# Altium project TK105_Hodetelefonforsterker.PrjPCB
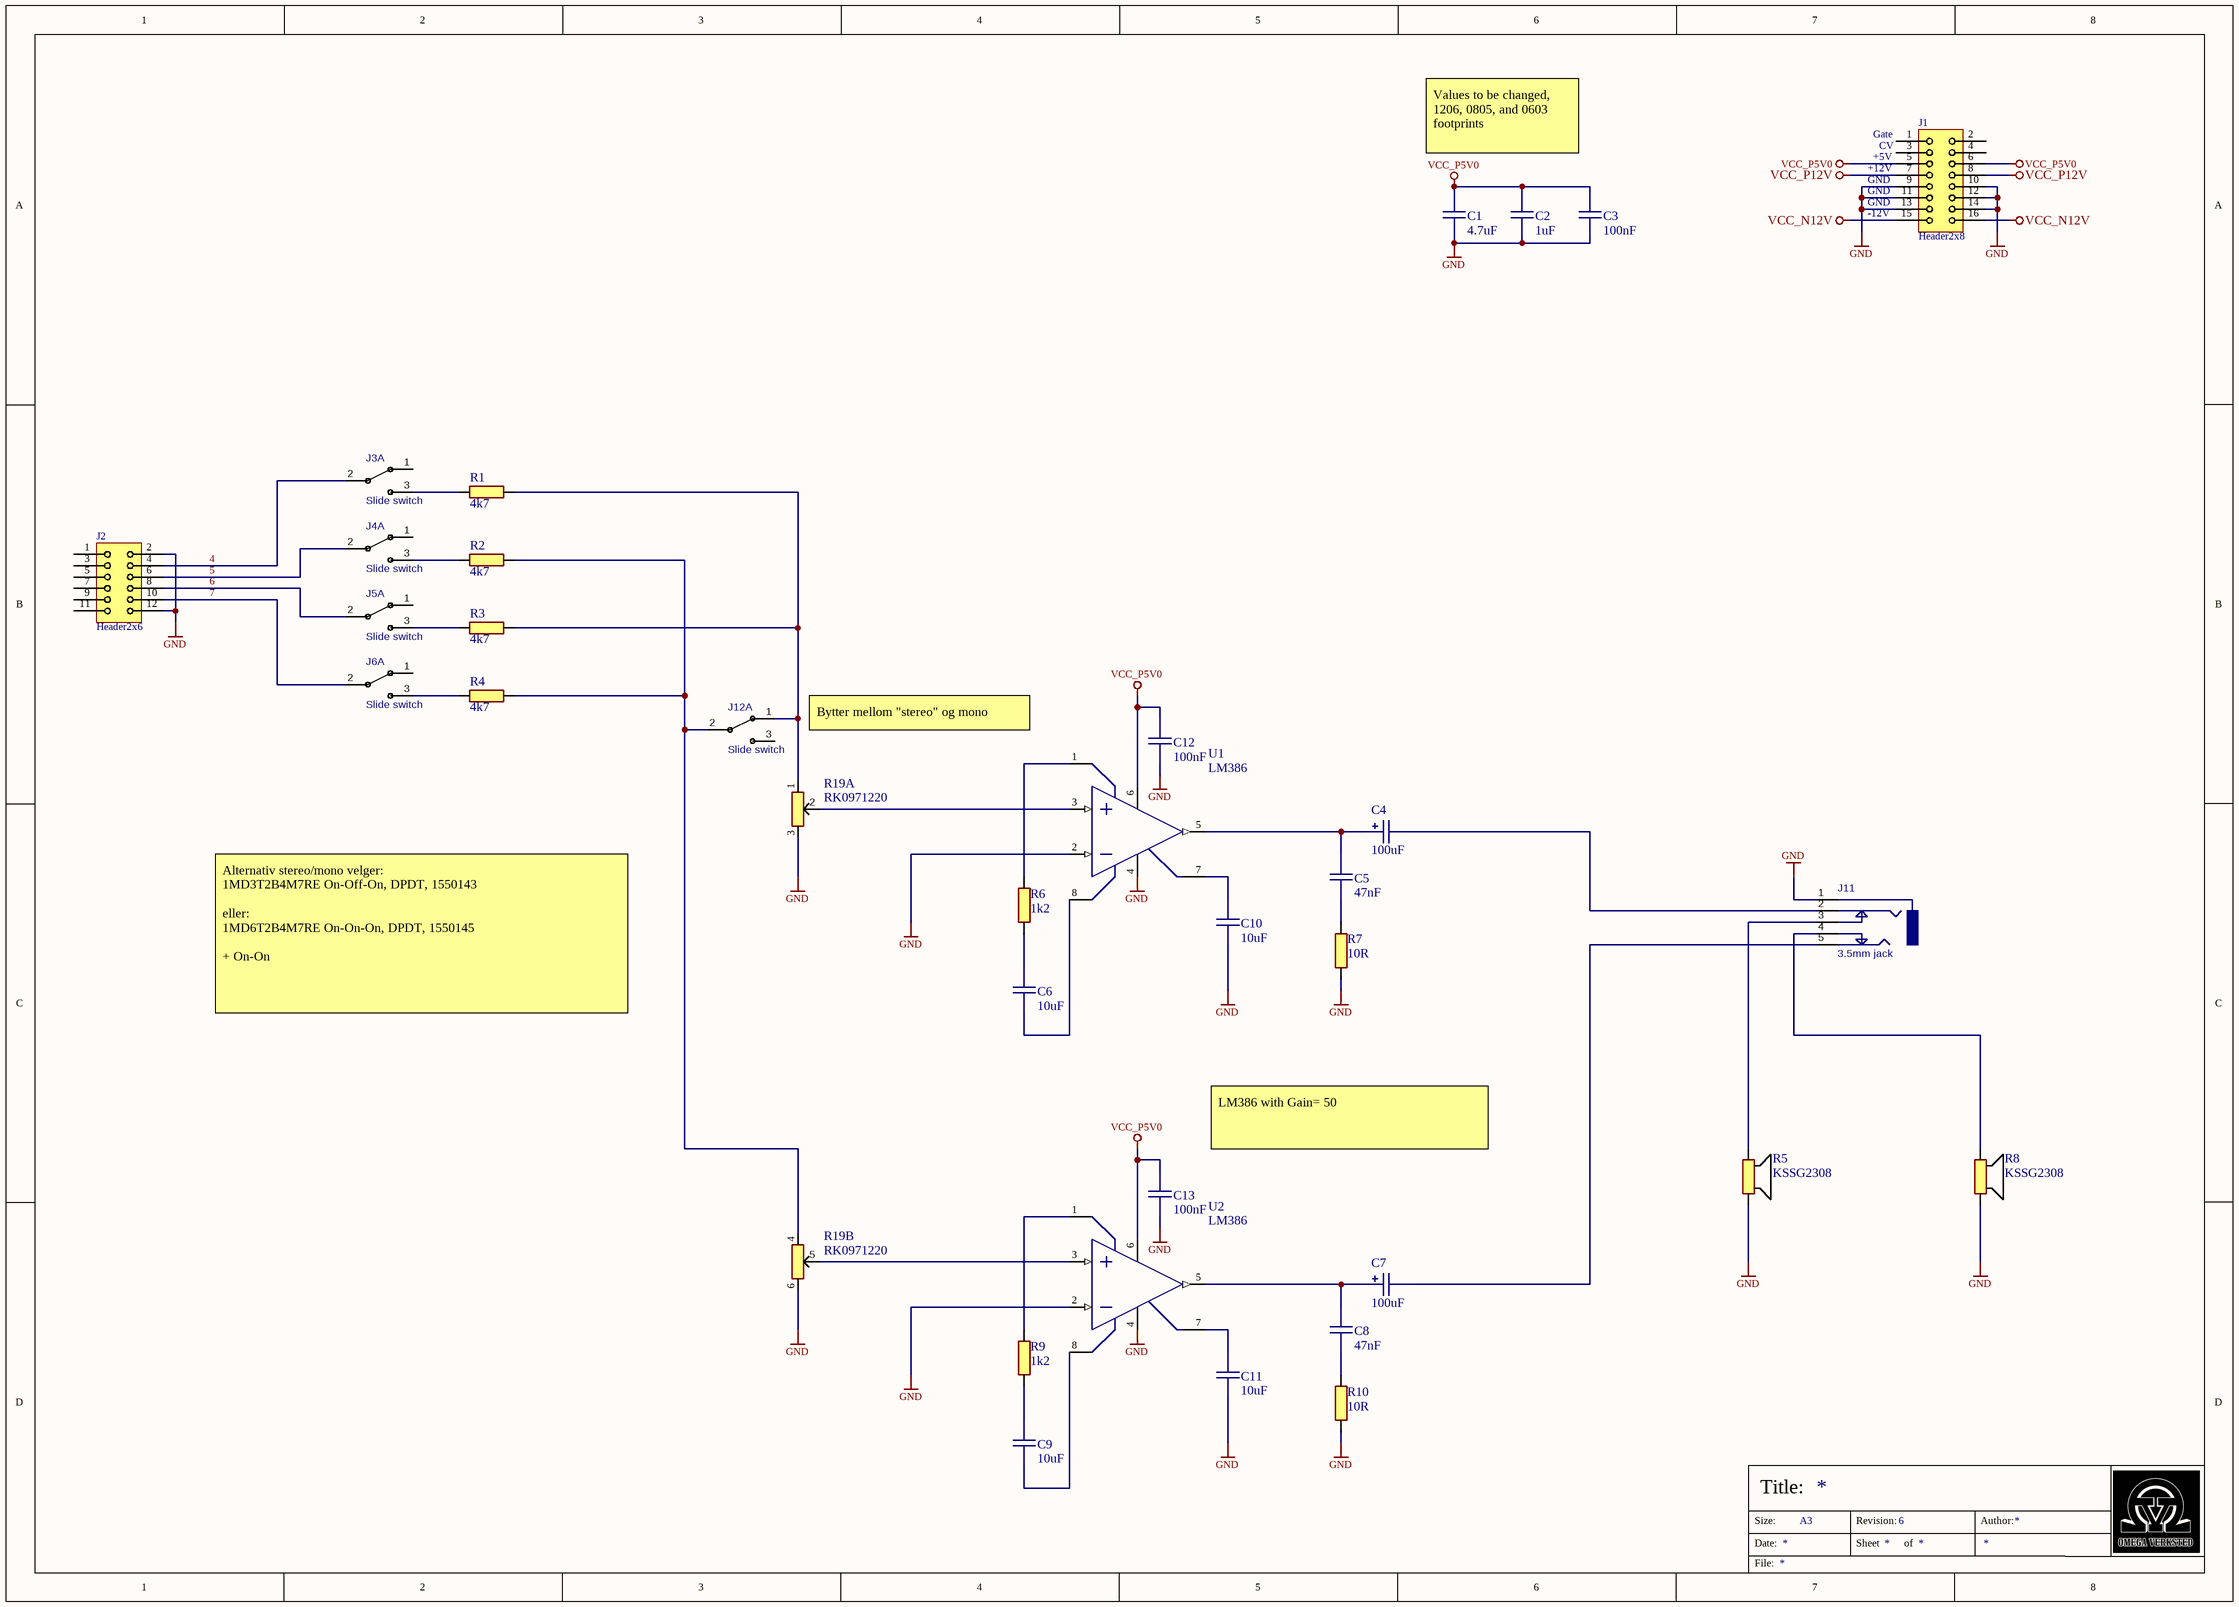
[diagram p0: TK105_Hodetelefonforsterker.SchDoc]
1 sheet, 34 parts. Net scope: global (net labels, ports and power ports of the same name join across sheets).
Board file: TK105_Hodetelefonforsterker.PcbDoc

## Sheet TK105_Hodetelefonforsterker.SchDoc
size A3; Revision: 6

### Parts
C1  4.7uF  [CAPC1206(3216)170_N]
C2  1uF  [CAPC0805(2012)100_N]
C3  100nF  [CAPC0603(1608)55_N]
C4  100uF  [CAPPR25D06H11]
C5  47nF  [CAPC0603(1608)55_N]
C6  10uF  [CAPC0805(2012)100_N]
C7  100uF  [CAPPR25D06H11]
C8  47nF  [CAPC0603(1608)55_N]
C9  10uF  [CAPC0805(2012)100_N]
C10  10uF  [CAPC0805(2012)100_N]
C11  10uF  [CAPC0805(2012)100_N]
C12  100nF  [CAPC0603(1608)55_N]
C13  100nF  [CAPC0603(1608)55_N]
J1  Header2x8  [HDRV16W64P254_2X8_Shrouded]
J2  Header2x6  [HDRV12W64P254_2X6_RA]
J3  Slide switch  [1MS1T2B4M7RE]  (part A of 2)
J4  Slide switch  [1MS1T2B4M7RE]  (part A of 2)
J5  Slide switch  [1MS1T2B4M7RE]  (part A of 2)
J6  Slide switch  [1MS1T2B4M7RE]  (part A of 2)
J11  3.5mm jack  [PJ-306M]
J12  Slide switch  [1MS1T2B4M7RE]  (part A of 2)
R1  4k7  [RESC0603(1608)_N]
R2  4k7  [RESC0603(1608)_N]
R3  4k7  [RESC0603(1608)_N]
R4  4k7  [RESC0603(1608)_N]
R5  KSSG2308  [KSSG2308]
R6  1k2  [RESC0603(1608)_N]
R7  10R  [RESC0603(1608)_N]
R8  KSSG2308  [KSSG2308]
R9  1k2  [RESC0603(1608)_N]
R10  10R  [RESC0603(1608)_N]
R19  RK0971220  [RK0971220]  (parts A,B of 2)
U1  LM386  [SOIC127P590X363-8N]
U2  LM386  [SOIC127P590X363-8N]

### Nets
GND: C1.1 C2.1 C3.1 C10.1 C11.1 C12.1 C13.1 J1.9 J1.10 J1.11 J1.12 J1.13 J1.14 J2.2 J2.12 J11.1 R5.2 R7.1 R8.2 R10.1 R19.3 R19.6 U1.2(IN-) U1.4(GND) U2.2(IN-) U2.4(GND)
VCC_N12V: J1.15 J1.16
VCC_P5V0: C1.2 C2.2 C3.2 C12.2 C13.2 J1.5 J1.6 U1.6(Vs) U2.6(Vs)
VCC_P12V: J1.7 J1.8
4: J2.4 J3.2
5: J2.6 J4.2
6: J2.8 J5.2
7: J2.10 J6.2
NetC4_1: C4.1 J11.2
NetC4_2: C4.2 C5.2 U1.5(OUT)
NetC5_1: C5.1 R7.2
NetC6_1: C6.1 U1.8(GAIN)
NetC6_2: C6.2 R6.1
NetC7_1: C7.1 J11.5
NetC7_2: C7.2 C8.2 U2.5(OUT)
NetC8_1: C8.1 R10.2
NetC9_1: C9.1 U2.8(GAIN)
NetC9_2: C9.2 R9.1
NetC10_2: C10.2 U1.7(BYPASS)
NetC11_2: C11.2 U2.7(BYPASS)
NetJ3_3: J3.3 R1.1
NetJ4_3: J4.3 R2.1
NetJ5_3: J5.3 R3.1
NetJ6_3: J6.3 R4.1
NetJ11_3: J11.3 R5.1
NetJ11_4: J11.4 R8.1
NetJ12_1: J12.1 R1.2 R3.2 R19.1
NetJ12_2: J12.2 R2.2 R4.2 R19.4
NetR6_2: R6.2 U1.1(GAIN)
NetR9_2: R9.2 U2.1(GAIN)
NetR19_2: R19.2 U1.3(IN+)
NetR19_5: R19.5 U2.3(IN+)

Not connected (* = marked no-connect by the designer): J1 1 2 3 4; J2 1 3 5 7 9 11; J3 1; J4 1; J5 1; J6 1; J12 3

### Notes on the sheet
- Values to be changed, 1206, 0805, and 0603 footprints
- (near J1) GND
- (near J1) +12V
- (near J1) +5V
- (near J1) Gate
- (near J1) CV
- (near J1) -12V
- Bytter mellom "stereo" og mono
- Alternativ stereo/mono velger:
  1MD3T2B4M7RE On-Off-On, DPDT, 1550143
  eller:
  1MD6T2B4M7RE On-On-On, DPDT, 1550145
  + On-On
- LM386 with Gain= 50
- Size:
- Date:
- Title:
- A3
- Revision:
- Sheet
- of
- Author:
- File:

### Library data of the parts
C1 = 2992: X7R 50V; id: 2992; pakke_opprettet_av: 815; pakke_opprettet: 11.02.2015 13.21.22; symbol_opprettet: 14.11.2014 20.19.34; pris: 1; nokkelord: Kondensator, capacitor; produsent: Multikomp; pakketype: 1206; symbol_opprettet_av: 815; navn: 4.7uF
C2 = 3582: X7R 50V 10%; id: 3582; pakke_opprettet_av: 815; pakke_opprettet: 14.11.2014 20.52.01; symbol_opprettet: 14.11.2014 20.19.34; leverandor_varenr: 1735541; pris: 4; nokkelord: Kondensator, capacitor; produsent: Murata; leverandor: Farnell; pakketype: 0805; symbol_opprettet_av: 815; navn: 1uF
C3 = 3028: X7R 50V 5%; id: 3028; pakke_opprettet_av: 815; pakke_opprettet: 18.02.2015 14.18.13; symbol_opprettet: 14.11.2014 20.19.34; leverandor_varenr: 1759122; pris: 1; nokkelord: Kondensator, Capacitor, CAP; produsent: Multikomp; leverandor: Farnell; pakketype: 0603; symbol_opprettet_av: 815; navn: 100nF
C4 C7 = 4858: 25V 2.5mm pitch; id: 4858; rad: 7; rom: OV; lager_type: Fremlager; dybde: 1; hylle: 4; antall: 40; pakke_opprettet_av: 815; leverandor_varenr: 1848439; pris: 2; nokkelord: Cap, Kondensator; produsent: Panasonic; leverandor: Farnell; pakketype: CAPPR; pakke_opprettet: 28/06/2014 17:35:52; symbol_opprettet_av: 815; symbol_opprettet: 28/06/2014 15:26:13; navn: 100uF; komponenttype: 2
C5 C8 = 5656: X7R 50V 5%; id: 5656; pakke_opprettet_av: 815; leverandor_varenr: 1759116; pris: 1; nokkelord: Kondensator, Capacitor, CAP; produsent: Multikomp; leverandor: Farnell; pakketype: 0603; komponenttype: 2; pakke_opprettet: 18/02/2015 14:18:13; symbol_opprettet_av: 815; symbol_opprettet: 14/11/2014 20:19:34; navn: 47nF
C6 C9-C11 = 3114: X5R 6.3V 10%; id: 3114; pakke_opprettet_av: 815; leverandor_varenr: 2320852; pris: 0; leverandor: Farnell; pakketype: 0805; komponenttype: 2; pakke_opprettet: 14/11/2014 20:52:01; symbol_opprettet_av: 815; symbol_opprettet: 14/11/2014 20:19:34; navn: 10uF
C12 C13 = 5152: X7R 50V 5%; id: 5152; rad: 21; rom: OV; lager_type: Baklager; dybde: 0; antall: 1000; pakke_opprettet_av: 815; leverandor_varenr: 1759122; pris: 1; nokkelord: Kondensator, Capacitor, CAP; produsent: Multikomp; leverandor: Farnell; pakketype: 0603; komponenttype: 2; hylle: 0; pakke_opprettet: 18/02/2015 14:18:13; symbol_opprettet_av: 815; symbol_opprettet: 14/11/2014 20:19:34; navn: 100nF
J1 = 4645: id: 4645; pakke_opprettet_av: 815; beskrivelse: Header; navn: Header Shrouded 2X8P; pris: 10; pakketype: TH; pakke_opprettet: 2019-02-14 23:39:48; symbol_opprettet_av: 815; symbol_opprettet: 2014-11-13 11:08:32; nokkelord: Header
J2 = 4624: Header; id: 4624; pakke_opprettet_av: 815; navn: Header 2X6 Right Angle; pris: 6; pakketype: TH; komponenttype: 11; pakke_opprettet: 16/02/2019 14:15:04; symbol_opprettet_av: 815; symbol_opprettet: 13/11/2014 11:04:02; nokkelord: Header
J3-J6 J12 = 4582: Toggle Switch SPDT On-On; id: 4582; pakke_opprettet_av: 815; symbol_opprettet_av: 1335; leverandor_varenr: 9473297; pris: 36; nokkelord: 1M Series; produsent: Multicomp; leverandor: Farnell; pakketype: TH; pakke_opprettet: 12/02/2019 23:53:13; symbol_opprettet: 20/02/2017 18:08:19; navn: 1MS1T2B4M7RE
J11 = 3138: PCB panel mount PJ-306M; id: 3138; rad: 2; rom: OV; lager_type: Fremlager; dybde: 1; hylle: 5; antall: 0; pakke_opprettet_av: 1335; pakketype: TH; produsent: CUI Inc.; komponenttype: 11; pakke_opprettet: 16/11/2016 18:13:13; symbol_opprettet_av: 1335; symbol_opprettet: 16/11/2016 18:31:54; navn: 3.5mm jack; pris: 5; nokkelord: PJ-306M
R1-R4 = 5393: 0.1W 1% Thick film resistor; id: 5393; rad: -1; rom: OV; lager_type: Fremlager; dybde: 64; hylle: 2; antall: 100; pakke_opprettet_av: 815; pris: 0; pakketype: 0603; komponenttype: 1; pakke_opprettet: 08/07/2014 21:15:30; symbol_opprettet_av: 815; symbol_opprettet: 08/07/2014 21:16:33; navn: 4k7
R5 R8 = 4630: Speaker, Micro, 150 mW, 8 ohm, 1.5 kHz to 6 kHz; id: 4630; pakke_opprettet_av: 815; leverandor_varenr: 2215102; pris: 25; nokkelord: høyttaler; produsent: Kingstate; leverandor: Farnell; pakketype: TH; pakke_opprettet: 18/02/2019 11:30:28; symbol_opprettet_av: 815; symbol_opprettet: 18/02/2019 11:23:08; navn: KSSG2308
R6 R9 = 5024: 0.1W 1% Thick film resistor; id: 5024; rad: -1; rom: OV; lager_type: Fremlager; dybde: 50; hylle: 2; antall: 100; pakke_opprettet_av: 815; pris: 0; pakketype: 0603; komponenttype: 1; pakke_opprettet: 08/07/2014 21:15:30; symbol_opprettet_av: 815; symbol_opprettet: 08/07/2014 21:16:33; navn: 1k2
R7 R10 = 5657: 0.1W 1% Thick film resistor; id: 5657; pakke_opprettet_av: 815; pris: 0; pakketype: 0603; komponenttype: 1; pakke_opprettet: 08/07/2014 21:15:30; symbol_opprettet_av: 815; symbol_opprettet: 08/07/2014 21:16:33; navn: 10R
R19 = 3059: Stereo logarithmic potmeter; id: 3059; rad: 2778; rom: GM; lager_type: Baklager; dybde: 0; antall: 100; pakke_opprettet_av: 1335; pris: 5; nokkelord: potensiometer; produsent: Alps; pakketype: TH; komponenttype: 1; hylle: 0; pakke_opprettet: 03/11/2016 16:35:58; symbol_opprettet_av: 1335; symbol_opprettet: 03/11/2016 16:45:25; navn: RK0971220
U1 U2 = 3018: Audio Power Amplifier, AB, 1 Channel, 4V to 12V, MSOP, 8 Pins; id: 3018; pakke_opprettet_av: 774; symbol_opprettet_av: 815; leverandor_varenr: 3116862; pris: 0; nokkelord: amp, headphone, forsterker; produsent: Texas Instruments; leverandor: Farnell; pakketype: SOIC; komponenttype: 15; pakke_opprettet: 23/08/2014 14:54:32; symbol_opprettet: 05/08/2019 20:42:43; navn: LM386

## Assembly variants
Default assembly: not fitted R?